# EAGLE design Digital_Output_A (EAGLE 9.5.1)
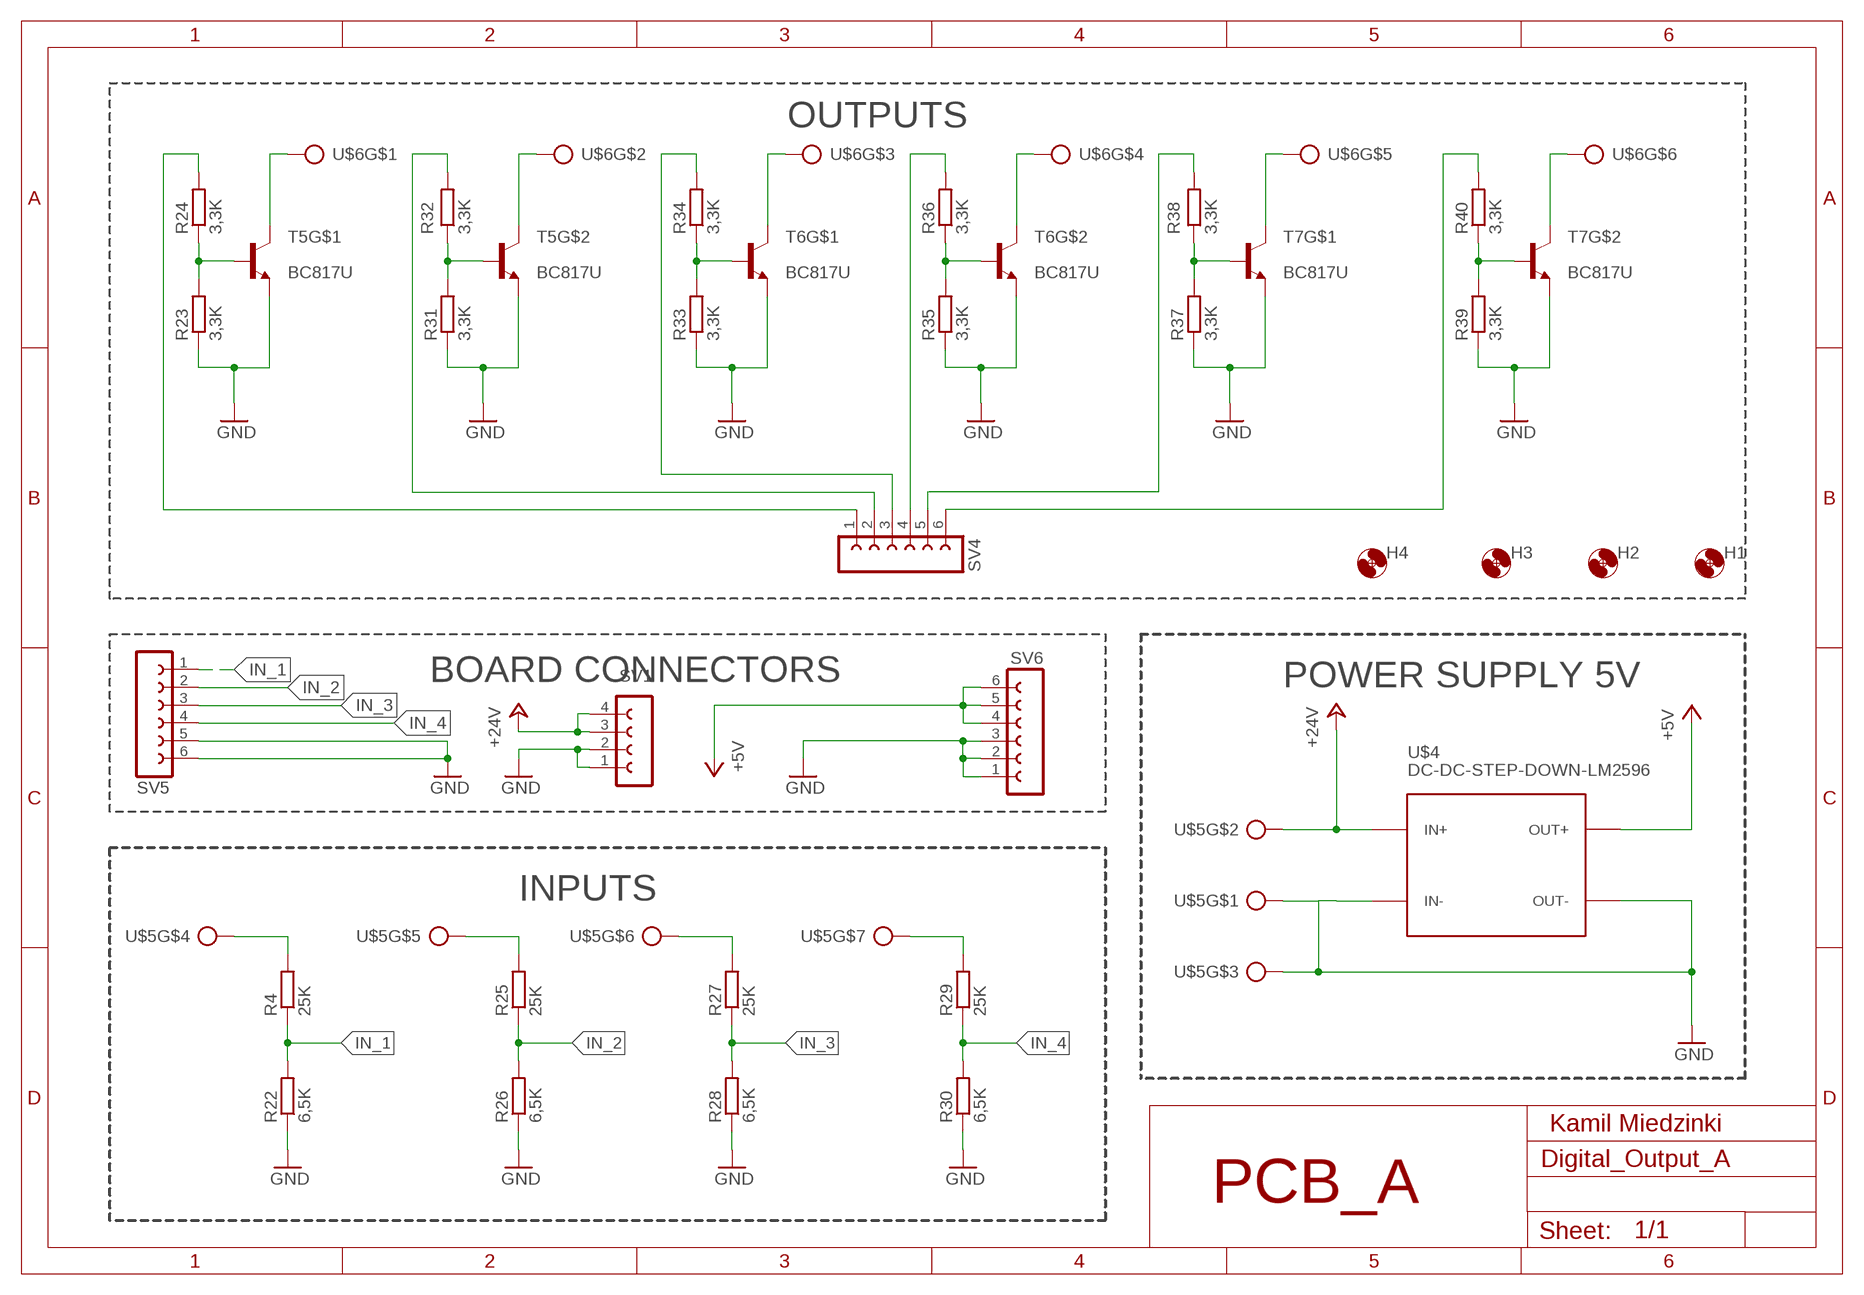
[diagram p0: schematic, sheet 1]

## Parts
H1  MOUNT-HOLE3.3  [3,3]
H2  MOUNT-HOLE3.3  [3,3]
H3  MOUNT-HOLE3.3  [3,3]
H4  MOUNT-HOLE3.3  [3,3]
R4  25K  R-EU_0204/7  [0204/7]
R22  6,5K  R-EU_0204/7  [0204/7]
R23  3,3K  R-EU_0204/7  [0204/7]
R24  3,3K  R-EU_0204/7  [0204/7]
R25  25K  R-EU_0204/7  [0204/7]
R26  6,5K  R-EU_0204/7  [0204/7]
R27  25K  R-EU_0204/7  [0204/7]
R28  6,5K  R-EU_0204/7  [0204/7]
R29  25K  R-EU_0204/7  [0204/7]
R30  6,5K  R-EU_0204/7  [0204/7]
R31  3,3K  R-EU_0204/7  [0204/7]
R32  3,3K  R-EU_0204/7  [0204/7]
R33  3,3K  R-EU_0204/7  [0204/7]
R34  3,3K  R-EU_0204/7  [0204/7]
R35  3,3K  R-EU_0204/7  [0204/7]
R36  3,3K  R-EU_0204/7  [0204/7]
R37  3,3K  R-EU_0204/7  [0204/7]
R38  3,3K  R-EU_0204/7  [0204/7]
R39  3,3K  R-EU_0204/7  [0204/7]
R40  3,3K  R-EU_0204/7  [0204/7]
SV1  FE04-1  [FE04-1]
SV4  FE06-1  [FE06]
SV5  FE06-1  [FE06]
SV6  FE06-1  [FE06]
T5  BC817U  [INF-SC74]
T6  BC817U  [INF-SC74]
T7  BC817U  [INF-SC74]
U$4  DC-DC-STEP-DOWN-LM2596  [DC-DC-STEP-DOWN-LM2596]
U$5  24V  MKDSN2,5/7  [MKDSN2,5/7]
U$6  MKDSN2,5/6  [MKDSN2,5/6]

## Nets
+5V: SV6.4 SV6.5 SV6.6 U$4.OUT+
+24V: SV1.3 SV1.4 U$4.IN+ U$5.2
GND: R22.1 R23.1 R26.1 R28.1 R30.1 R31.1 R33.1 R35.1 R37.1 R39.1 SV1.1 SV1.2 SV5.5 SV5.6 SV6.1 SV6.2 SV6.3 T5.1(E) T5.4(E) T6.1(E) T6.4(E) T7.1(E) T7.4(E) U$4.IN- U$4.OUT- U$5.1 U$5.3
IN_1: R4.1 R22.2 SV5.1
IN_2: R25.1 R26.2 SV5.2
IN_3: R27.1 R28.2 SV5.3
IN_4: R29.1 R30.2 SV5.4
N$25: R4.2 U$5.4
N$26: R25.2 U$5.5
N$27: R27.2 U$5.6
N$28: R29.2 U$5.7
N$29: T5.6(C) U$6.1
N$30: R23.2 R24.1 T5.2(B)
N$31: R24.2 SV4.1
N$32: T5.3(C) U$6.2
N$33: R31.2 R32.1 T5.5(B)
N$34: R32.2 SV4.2
N$35: T6.6(C) U$6.3
N$36: R33.2 R34.1 T6.2(B)
N$37: R34.2 SV4.3
N$38: T6.3(C) U$6.4
N$39: R35.2 R36.1 T6.5(B)
N$40: R36.2 SV4.4
N$41: T7.6(C) U$6.5
N$42: R37.2 R38.1 T7.2(B)
N$43: R38.2 SV4.5
N$44: T7.3(C) U$6.6
N$45: R39.2 R40.1 T7.5(B)
N$46: R40.2 SV4.6

## Notes on the sheet
- OUTPUTS
- BOARD CONNECTORS | POWER SUPPLY 5V
- INPUTS
- Kamil Miedzinki
- PCB_A

## Library data of the parts
H1-H4 = holes:MOUNT-HOLE: MOUNTING HOLE with drill center marker
R4 R22-R40 = rcl:R-EU_: RESISTOR, European symbol; SPICEPREFIX: R
SV1 = con-lsta:FE04-1: FEMALE HEADER; OC_FARNELL: unknown; OC_NEWARK: unknown
SV4-SV6 = con-lsta:FE06-1: FEMALE HEADER; OC_FARNELL: unknown; OC_NEWARK: unknown
T5-T7 = transistor:BC817U: NPN TRANSISTOR
U$4 = diy-modules:DC-DC-STEP-DOWN-LM2596: DC/DC Step-Down Regulator based on LM2596-ADJ chip LM2596 datasheet available here: http://www.ti.com/lit/ds/symlink/lm2596.pdf Click here to find device on ebay.com <http://www.ebay.com/sch/lm2596+power+regulator>
U$5 = con-ptr500:MKDSN2,5/7
U$6 = con-ptr500:MKDSN2,5/6

## Board
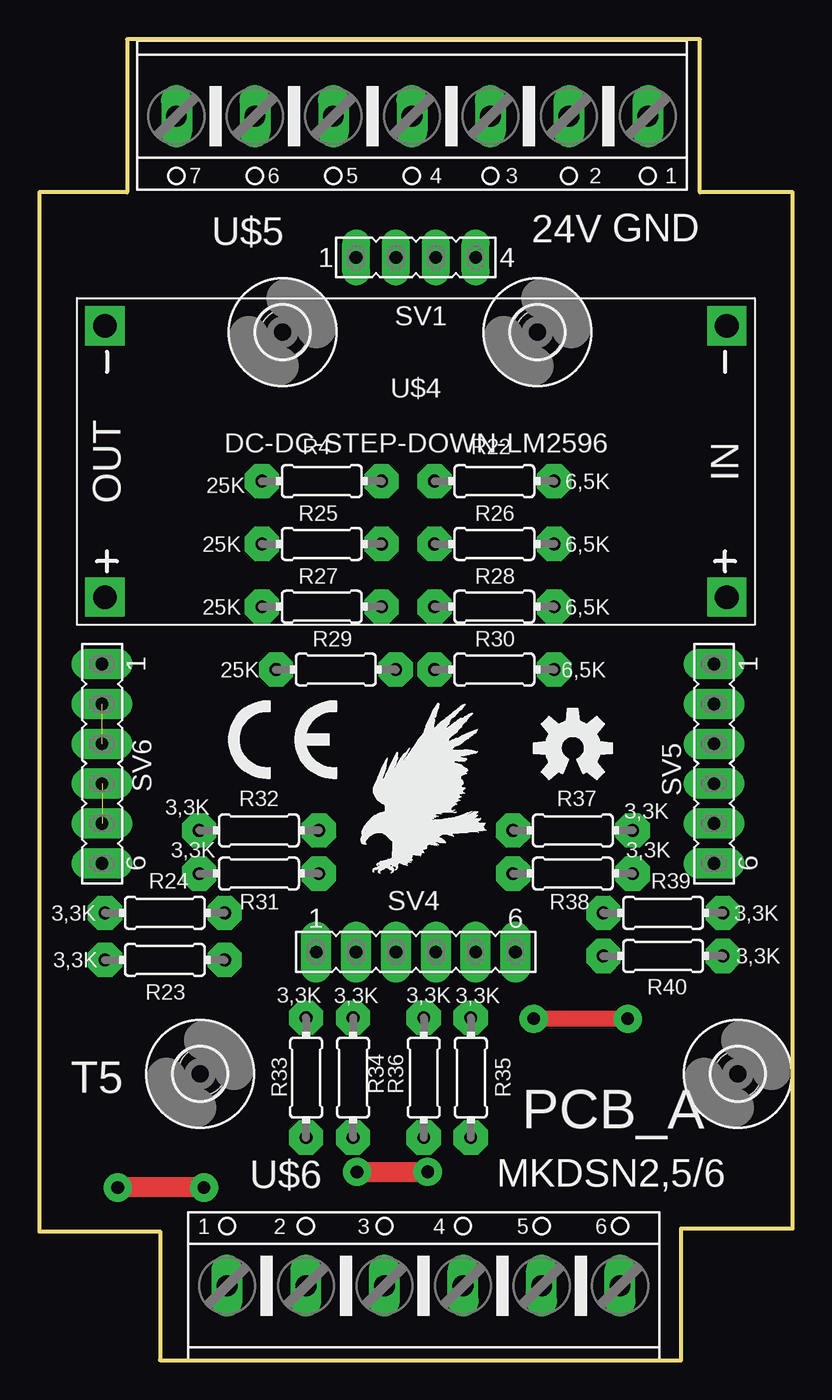
[diagram p1: board, top side]
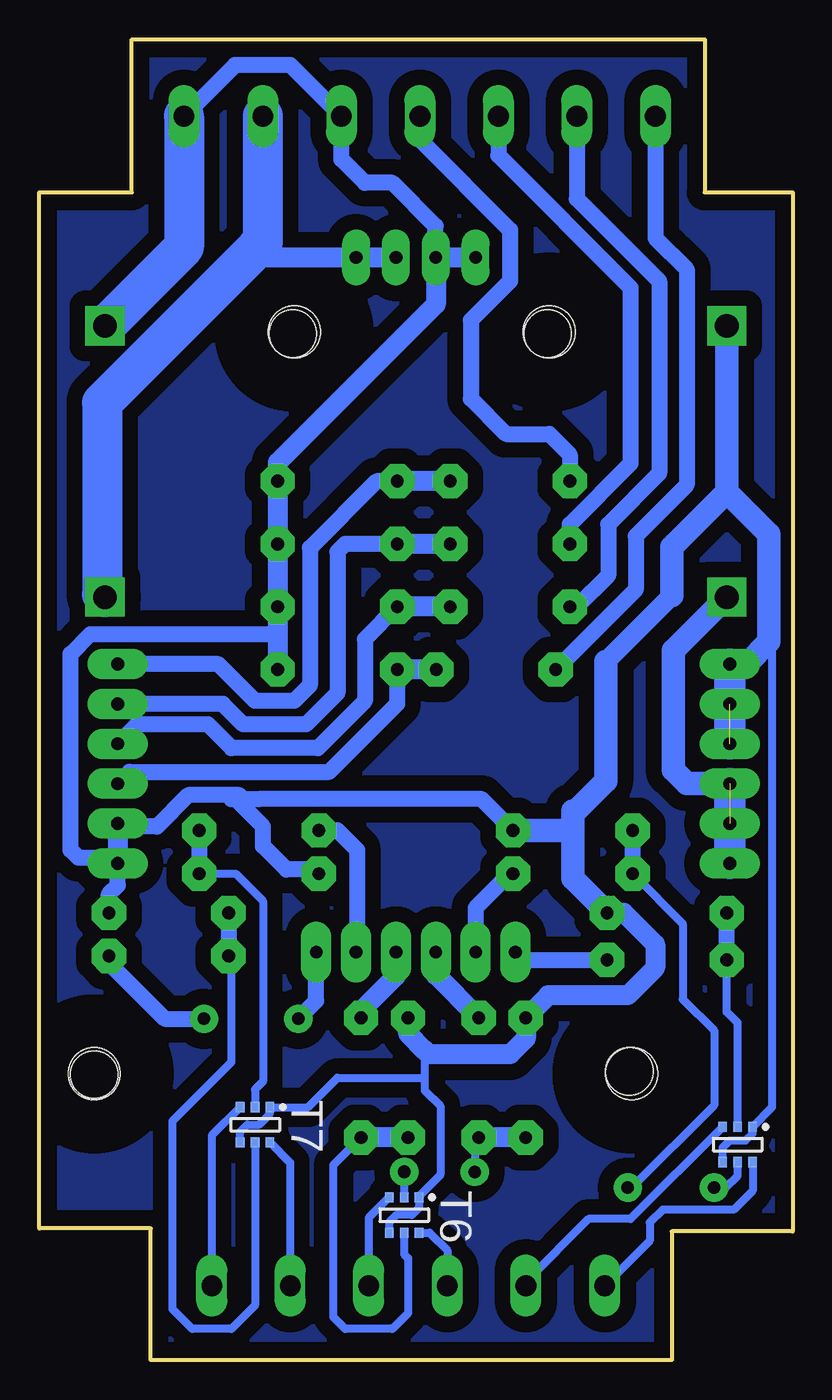
[diagram p2: board, bottom side, seen from below]

Size 48 x 84.15 mm. Coordinates in mm from the lower left corner, seen from the top.
Outline: 5.6,84.15 5.6,74.4 0,74.4 0,8.2 7.7,8.2 7.7,0 40.9,0 40.9,8.4 48,8.4 48,74.4 42.1,74.4 42.1,84.15 5.6,84.15
Copper layers (1*16): Top 0.035mm / dielectric 1.5mm / Bottom 0.035mm
Design rules "default": minimum track width 6mil, minimum drill 0.35mm, track to track 6mil, track to pad 6mil, pad to pad 6mil, via to via 6mil, smd to smd 6mil, copper to edge 40mil, drill to drill 6mil, minimum pad ring 10mil, minimum via ring 8mil, stop-mask expansion 4mil, vias tented up to drill 0mil, thermal gap 10mil
Holes 3 mm at 31.85,65.4 10.4,18.4 15.6,65.4 44.5,18.2

### Footprints (pad centres in the part's own frame; a part is rotated, then mirrored left to right if it is on the bottom)
3,3 = hole 3.3: 0,0
0204/7 = drill 0.813 pad 2.184 octagon: 1 -3.81,0; 2 3.81,0
FE04-1 = drill 0.813 pad 1.778 long: 1 -3.81,0; 2 -1.27,0; 3 1.27,0; 4 3.81,0
FE06 = drill 0.813 pad 1.93 long: 1 -6.35,0; 2 -3.81,0; 3 -1.27,0; 4 1.27,0; 5 3.81,0; 6 6.35,0
INF-SC74 = smd 0.65 x 0.55: 1 -1.125,0.95; 2 -1.125,0; 3 -1.125,-0.95; 4 1.125,-0.95; 5 1.125,0; 6 1.125,0.95
DC-DC-STEP-DOWN-LM2596 = drill 1.5 pad 2.5 square: IN+ -19.812,8.636; IN- -19.812,-8.636; OUT+ 19.812,8.636; OUT- 19.812,-8.636
MKDSN2,5/7 = drill 1.321 long: 1 -15.033,0; 2 -10.004,0; 3 -5,0; 4 0.004,0; 5 5.008,0; 6 10.008,0; 7 15.008,0
MKDSN2,5/6 = drill 1.321 long: 1 -12.533,0; 2 -7.504,0; 3 -2.5,0; 4 2.504,0; 5 7.508,0; 6 12.508,0

### Placement (x,y rotation side)
H1  10.25,18.25 0 top
H2  15.5,65.5 0 top
H3  44.5,18.25 0 top
H4  31.75,65.5 0 top
R4  18,56 180 top
R22  29,56 180 top
R23  8,28.5 180 top
R24  8,25.5 0 top
R25  18,52 180 top
R26  29,52 180 top
R27  18,48 180 top
R28  29,48 180 top
R29  18.9,44 180 top
R30  29,44 180 top
R31  14,33.75 180 top
R32  14,31 0 top
R33  17,18 270 top
R34  20,18 90 top
R35  24.5,18 270 top
R36  27.5,18 90 top
R37  34,31 0 top
R38  34,33.75 180 top
R39  39.75,28.5 180 top
R40  39.75,25.75 0 top
SV1  24,70.25 0 top
SV4  24,26 0 top
SV5  43,38 270 top
SV6  4,38 270 top
T5  3.5,13.75 270 bottom
T6  24.75,9.25 270 bottom
T7  34.25,15 270 bottom
U$1  [CE_5MM]  12,37 0 top
U$2  [EAGLE-PLC-8MM]  20.5,31 0 top
U$3  [OSHW-LOGO-M]  34,39 0 top
U$4  24,57.25 180 top
U$5  23.75,79.25 180 top
U$6  24.5,4.75 0 top

### Tracks (layer width: path | path; a pad name or v marks a point on that pad's centre or on a via)
+5V  (1 unrouted)
  Bottom 1.5: SV6.4 6.73,36.73 7.6,37.6 7.6,45.2 U$4.OUT+
  Bottom 2: U$4.OUT+ 4,48.61 | SV6.6 SV6.4
+24V
  Bottom 1.27: SV1.3 SV1.4 34.75,70.25
  Bottom 2.54: U$5.2 33.75,71.25 34.75,70.25 44,61 44,48.8 U$4.IN+
GND  (1 unrouted)
  Bottom 0.508: T5.4 4.45,13.55 4,14 3,14 2.55,14.45 T5.1 1.3,16.13 1.3,45.58 1.5,45.78 | T6.4 25.7,8.8 25.25,9.25 24.25,9.25 23.8,9.7 T6.1 23.8,10.45 22.44,11.81 22.44,16.19 23.44,17.19 23.44,18 | 23.44,19.75 23.44,18 | T7.4 35.2,14.55 34.75,15 34,15 33.3,15.7 T7.1 30.88,16.12 29,18 23.44,18
  Bottom 1.016: SV1.2 22.75,70.27 22.75,72.25 25.5,75 27.25,75 28.75,76.5 U$5.3 32,82.5 35.53,82.5 U$5.1 | R37.1 30.44,31.25 32.25,31.25 33.75,32.75 33.75,34 35.5,35.75 | 44,34 40.5,34 38.5,36 36,36 | 36,36 35.25,36 35.5,35.75 | R39.1 43.56,29.69 43,30.25 SV5.6 43.35,32 45.5,32 46,32.5 46,45 44.75,46.25 32.81,46.25 | 35.5,35.75 34,35.75 19.81,35.75 R31.1 | 36,36 35.75,35.75 35.5,35.75
  Bottom 1.27: SV1.1 SV1.2 22.73,67.27 32.81,57.19 R22.1 R26.1 R28.1 32.81,46.25 R30.1 | 44,34 43,34 SV5.5 SV5.6 | R23.1 10.75,28.5 8.75,26.5 8.75,25 10.5,23.25 15.56,23.25 R33.1 17,20.5 18,19.5 23.19,19.5 23.44,19.75 24.5,20.81 R35.1 | 7.5,52 7.7,51.8 | 7.7,48.7 11.9,44.5 | SV6.1 2.93,44.35 | 17.81,33.81 R31.1
  Bottom 1.5: 4.19,55.31 U$4.OUT- | 4.19,55.31 7.5,52 | R23.1 14,30.69 14,33.75 | 14,33.75 14,35 13.8,35 11.9,36.9 11.9,44.5 | R31.1 14,33.75 | 7.7,51.8 7.7,48.7 | 2.93,44.35 1.5,45.78 1.5,52.62 4.19,55.31
  Bottom 2: SV6.3 SV6.1
  Bottom 2.54: U$5.1 38.78,70.92 U$4.IN-
IN_1
  Bottom 1.016: R22.2 26.5,56 30.75,51.75 30.75,43 31.75,42 34.25,42 36.6,44.35 SV5.1
  Bottom 1.27: R4.1 R22.2
IN_2
  Bottom 1.016: R26.2 28.5,52 29,51.5 29,42.5 31,40.5 35,40.5 36.31,41.81 SV5.2
  Bottom 1.27: R25.1 R26.2
IN_3
  Bottom 1.016: R28.2 27.25,45.94 27.25,42 30.25,39 35.75,39 37.25,40.5 41.77,40.5 SV5.3
  Bottom 1.27: R27.1 R28.2
IN_4
  Bottom 1.016: R30.2 25.19,41.81 29.52,37.48 42.25,37.48 SV5.4
  Bottom 1.27: R29.1 R30.2
N$1
  pour Bottom (isolate 1): 0,74.4 0,8.2 7.7,8.2 7.7,0 40.9,0 40.9,8.4 48,8.4 48,74.4 42.1,74.4 42.1,84.15 5.6,84.15 5.6,74.4
N$25
  Bottom 1.016: U$5.4 23.75,77.75 18,72 18,68.75 20.5,66.25 20.5,61.25 18.25,59 15.5,59 14.19,57.69 R4.2
N$26
  Bottom 1.016: U$5.5 18.74,77.51 18.75,77.5 18.75,76.75 10.32,68.32 10.32,57.12 14.19,53.25 R25.2
N$27
  Bottom 1.016: U$5.6 13.74,73.99 8.5,68.75 8.5,56.5 11.75,53.25 11.75,50 13.75,48 R27.2
N$28
  Bottom 1.016: U$5.7 8.74,71.49 6.75,69.5 6.75,55.75 10,52.5 10,49.09 R29.2
N$29
  Bottom 0.508: T5.6 2.55,10.8 3.75,9.6 8.28,9.6 9.1,8.78 9.1,7.62 U$6.1
N$30
  Bottom 0.508: T5.2 3.5,21.5 4.19,22.19 R24.1
  Bottom 1.016: R24.1 R23.2
N$31
  Bottom 1.016: SV4.1 17.15,25.5 R24.2
N$32
  Bottom 0.508: T5.3 10.32,9 13,9 17,5 U$6.2
N$33  (via drill 0.8 pad 1.8)
  Top 1.27: v10.5,11 v5,11
  Bottom 0.508: R32.1 7,27.81 7,23 5,21 5,16.25 10.25,11 v10.5,11 | v5,11 4.25,11 3.5,11.75 T5.5
  Bottom 1.016: R32.1 R31.2
N$34
  Bottom 1.016: R32.2 18,31 20.19,28.81 SV4.2
N$35
  Bottom 0.508: T6.6 23.12,8.12 22,7 U$6.3
N$36  (via drill 0.8 pad 1.8)
  Top 0.508: v24.75,12
  Top 1.27: v20.25,12 v24.75,12
  Bottom 0.508: R34.1 20.25,13.94 v20.25,12 | v24.75,12 T6.2
  Bottom 1.27: R33.2 R34.1
N$37
  Bottom 1.27: R34.2 22.73,24.54 SV4.3
N$38
  Bottom 0.508: T6.3 27,9.07 U$6.4
N$39
  Bottom 0.508: R36.1 29.25,12.44 29.25,2.75 28.5,2 25.5,2 24.5,3 24.5,6.5 24.75,6.75 T6.5
  Bottom 1.27: R35.2 R36.1
N$40
  Bottom 1.27: SV4.4 25.27,24.48 27.5,22.25 R36.2
N$41
  Bottom 0.508: T7.6 32.01,12.58 U$6.5
N$42
  Bottom 0.508: R37.2 35.5,31 33.75,29.25 33.75,17.75 34.25,17.25 T7.2
  Bottom 1.016: R38.1 R37.2
N$43
  Bottom 1.016: R38.2 29,33.75 27.75,32.5 27.75,26.06 SV4.5
N$44
  Bottom 0.508: T7.3 37.01,14.32 U$6.6
N$45
  Bottom 0.508: T7.5 34.25,3.5 35.75,2 38.25,2 39.5,3.25 39.5,15.25 35.75,19 35.75,25.56 R40.1
  Bottom 1.016: R39.2 R40.1
N$46  (via drill 0.8 pad 1.8)
  Top 1.016: v37.5,21.75 v31.5,21.75
  Bottom 1.016: R40.2 43.56,25.31 40,21.75 v37.5,21.75 | v31.5,21.75 30.35,22.9 SV4.6

### Text on the board
tNames: GND | PCB_A